# EAGLE design T05_version11_7b (EAGLE 7.1.0)
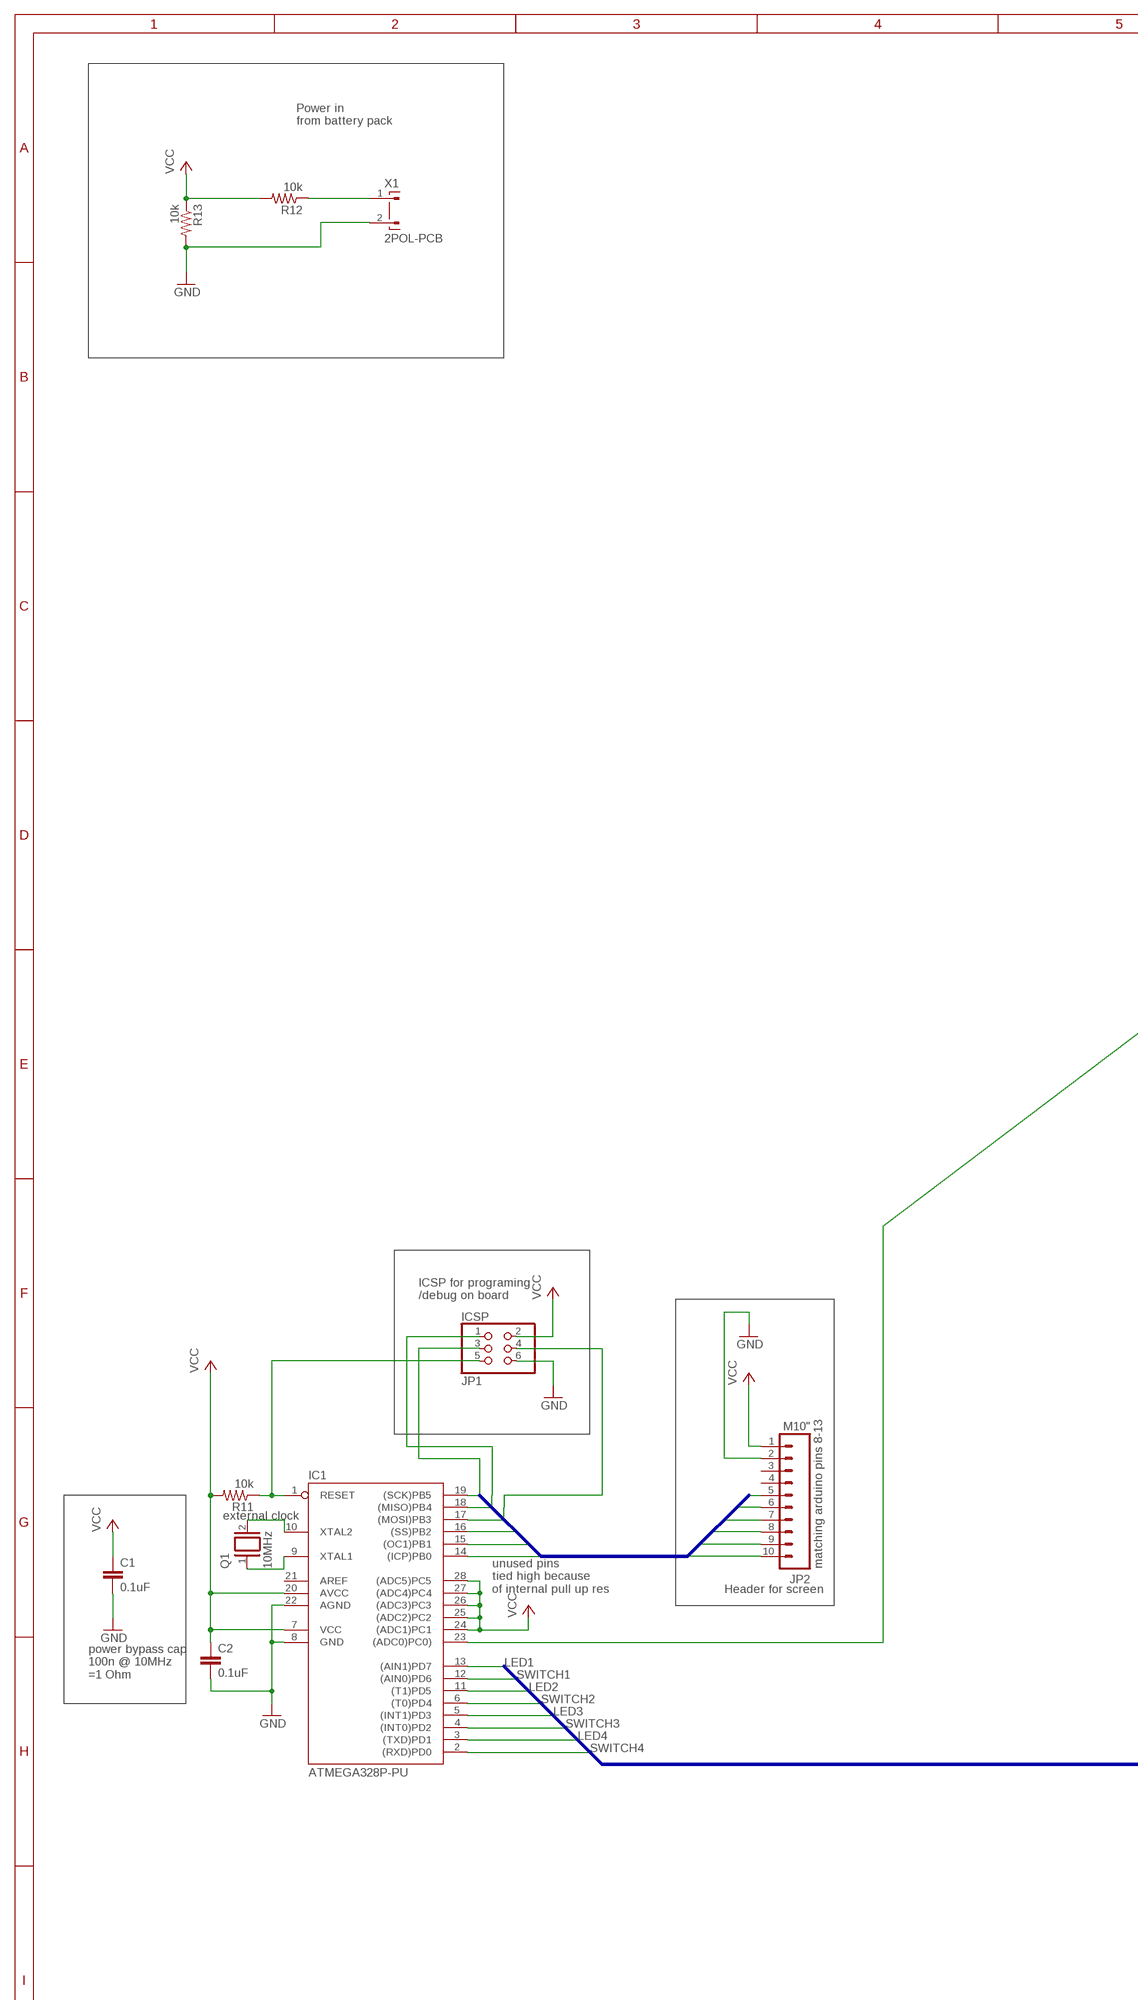
[diagram p0: schematic, sheet 1, part 1 of 2]
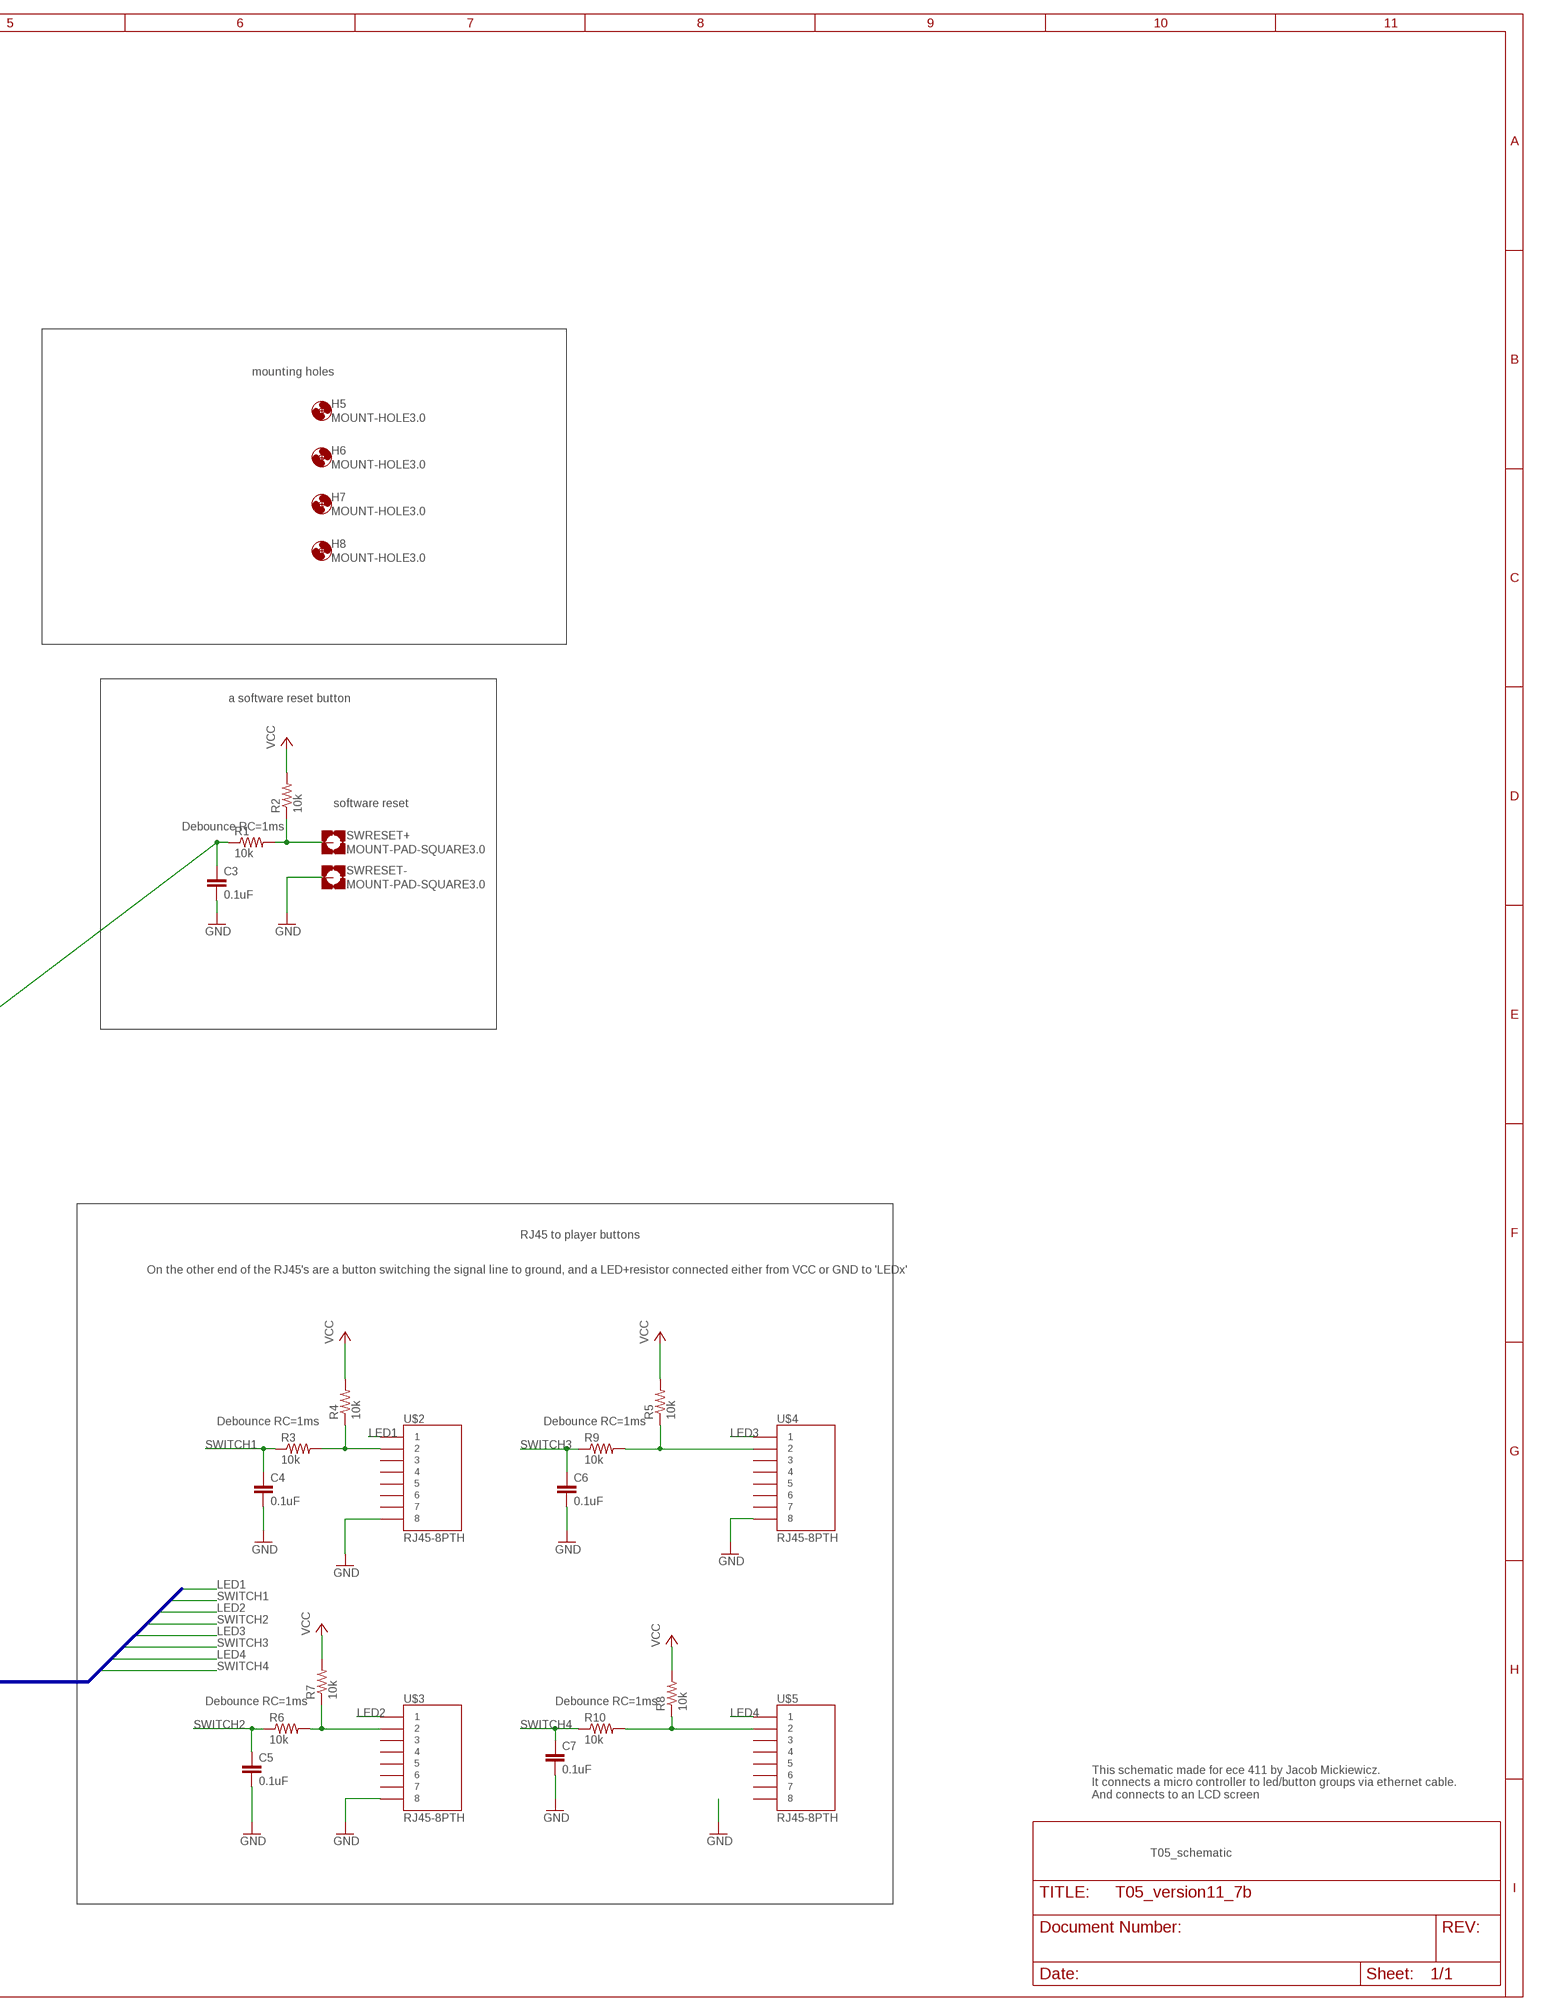
[diagram p1: schematic, sheet 1, part 2 of 2]

## Parts
C1  0.1uF  0.1UF-25V-5%(0603)  [0603-CAP]
C2  0.1uF  0.1UF-25V-5%(0603)  [0603-CAP]
C3  0.1uF  0.1UF-25V-5%(0603)  [0603-CAP]
C4  0.1uF  0.1UF-25V-5%(0603)  [0603-CAP]
C5  0.1uF  0.1UF-25V-5%(0603)  [0603-CAP]
C6  0.1uF  0.1UF-25V-5%(0603)  [0603-CAP]
C7  0.1uF  0.1UF-25V-5%(0603)  [0603-CAP]
H5  MOUNT-HOLE3.0  [3,0]
H6  MOUNT-HOLE3.0  [3,0]
H7  MOUNT-HOLE3.0  [3,0]
H8  MOUNT-HOLE3.0  [3,0]
IC1  ATMEGA328P-PU  [DIL28-3]
ICSP  JP1  PINHD-2X3  [2X03]
JP2  M10"  [1X10]
Q1  10MHz  XTAL/S  [QS]
R1  10k  RESISTOR0603-RES  [0603-RES]
R2  10k  RESISTOR0603-RES  [0603-RES]
R3  10k  RESISTOR0603-RES  [0603-RES]
R4  10k  RESISTOR0603-RES  [0603-RES]
R5  10k  RESISTOR0603-RES  [0603-RES]
R6  10k  RESISTOR0603-RES  [0603-RES]
R7  10k  RESISTOR0603-RES  [0603-RES]
R8  10k  RESISTOR0603-RES  [0603-RES]
R9  10k  RESISTOR0603-RES  [0603-RES]
R10  10k  RESISTOR0603-RES  [0603-RES]
R11  10k  RESISTOR0603-RES  [0603-RES]
R12  10k  RESISTOR0603-RES  [0603-RES]
R13  10k  RESISTOR0603-RES  [0603-RES]
SWRESET+  MOUNT-PAD-SQUARE3.0  [3,0-PAD-SQUARE]
SWRESET-  MOUNT-PAD-SQUARE3.0  [3,0-PAD-SQUARE]
U$2  RJ45-8PTH  [RJ45-8]
U$3  RJ45-8PTH  [RJ45-8]
U$4  RJ45-8PTH  [RJ45-8]
U$5  RJ45-8PTH  [RJ45-8]
X1  2POL-PCB  [2POL-PCB]

## Nets
GND: C1.2 C2.2 C3.2 C4.2 C5.2 C6.2 C7.2 IC1.8(GND) IC1.22(AGND) ICSP.6 JP2.2 R13.2 SWRESET-.B3,0(MOUNT) U$2.8 U$3.8 U$4.8 X1.2
ICP: IC1.14((ICP)PB0) JP2.10
LED1: IC1.13((AIN1)PD7) U$2.1
LED2: IC1.11((T1)PD5) U$3.1
LED3: IC1.5((INT1)PD3) U$4.1
LED4: IC1.3((TXD)PD1) U$5.1
MISO: IC1.18((MISO)PB4) ICSP.1 JP2.6
MOSI: IC1.17((MOSI)PB3) ICSP.4 JP2.7
N$3: IC1.1(RESET) ICSP.5 R11.1
N$8: R3.2 R4.1 U$2.2
N$9: R8.1 R10.2 U$5.2
N$10: R1.2 R2.1 SWRESET+.B3,0(MOUNT)
N$12: R6.2 R7.1 U$3.2
N$13: R5.1 R9.2 U$4.2
N$14: IC1.10(XTAL2) Q1.2
N$15: IC1.9(XTAL1) Q1.1
N$16: R12.1 X1.1
OC1: IC1.15((OC1)PB1) JP2.9
SCK: IC1.19((SCK)PB5) ICSP.3 JP2.5
SS: IC1.16((SS)PB2) JP2.8
SW_RESET: C3.1 IC1.23((ADC0)PC0)) R1.1
SWITCH1: C4.1 IC1.12((AIN0)PD6) R3.1
SWITCH2: C5.1 IC1.6((T0)PD4) R6.1
SWITCH3: C6.1 IC1.4((INT0)PD2) R9.1
SWITCH4: C7.1 IC1.2((RXD)PD0) R10.1
VCC: C1.1 C2.1 IC1.7(VCC) IC1.20(AVCC) IC1.24((ADC1)PC1) IC1.25((ADC2)PC2) IC1.26((ADC3)PC3) IC1.27((ADC4)PC4) IC1.28((ADC5)PC5) ICSP.2 JP2.1 R2.2 R4.2 R5.2 R7.2 R8.2 R11.2 R12.2 R13.1
Unconnected: IC1.21(AREF) JP2.3 JP2.4 U$2.3 U$2.4 U$2.5 U$2.6 U$2.7 U$3.3 U$3.4 U$3.5 U$3.6 U$3.7 U$4.3 U$4.4 U$4.5 U$4.6 U$4.7 U$5.3 U$5.4 U$5.5 U$5.6 U$5.7 U$5.8

## Buses
PLAYER_BUTTONS:LED[1..4],SWITCH[1..4]
PORT_B:SCK,MISO,MOSI,SS,OC1,ICP

## Notes on the sheet
- Power in
  from battery pack
- mounting holes
- a software reset button
- software reset
- Debounce RC=1ms
- ICSP for programing
  /debug on board
- RJ45 to player buttons
- On the other end of the RJ45's are a button switching the signal line to ground, and a LED+resistor connected either from VCC or GND to 'LEDx'
- Debounce RC=1ms | Debounce RC=1ms
- external clock
- matching arduino pins 8-13
- unused pins
  tied high because 
  of internal pull up res
- Header for screen
- power bypass cap
  100n @ 10MHz
  =1 Ohm
- Debounce RC=1ms | Debounce RC=1ms
- This schematic made for ece 411 by Jacob Mickiewicz.
  It connects a micro controller to led/button groups via ethernet cable.
  And connects to an LCD screen
- T05_schematic

## Library data of the parts
C1-C7 = SparkFun-Capacitors:0.1UF-25V-5%(0603): CAP-08604; PROD_ID: CAP-08604
H5-H8 = holes:MOUNT-HOLE: MOUNTING HOLE with drill center marker
IC1 = SmartPrj:ATMEGA328P-: MICROCONTROLLER 4 Kbytes FLASH 128 bytes SRAM 256 bytes EEPROM UART 6-channel 10 bit ADC
ICSP = SparkFun-Connectors:PINHD-2X3: PIN HEADER
JP2 = SparkFun-Connectors:M10: Header 10 Standard 10-pin 0.1" header. Use with straight break away headers (SKU : PRT-00116), right angle break away headers (PRT-00553), swiss pins (PRT-00743), machine pins (PRT-00117), and female headers (PRT-00115).
Q1 = special:XTAL/S: CRYSTAL
R1-R13 = SparkFun-Passives:RESISTOR: Resistor Basic schematic elements and footprints for 0603, 1206, and PTH resistors.
SWRESET+ SWRESET- = holes:MOUNT-PAD-SQUARE: MOUNTING PAD, square
U$2-U$5 = SparkFun-Connectors:RJ45-8: RJ45 Jack Simple RJ45, 8-pin connection - connector for common Cat5, Cat5e, and Cat6 Ethernet cables. Footprint not yet proven in production. Connector sku is PRT-00643; Breakout PCB sku is BOB-00716.
X1 = con-friwo:2POL-PCB: PCB SUPPLY CONNECTOR FRIWO (TEXAS); OC_FARNELL: unknown; OC_NEWARK: unknown

## Net classes
0 gnd: width 0.813 mm, clearance 0.178 mm
1 vcc: width 0.813 mm, clearance 0.178 mm to class 0, clearance 0.178 mm
2 default: width 0.254 mm, clearance 0.178 mm to class 0, clearance 0.178 mm to class 1, clearance 0.178 mm

## Board
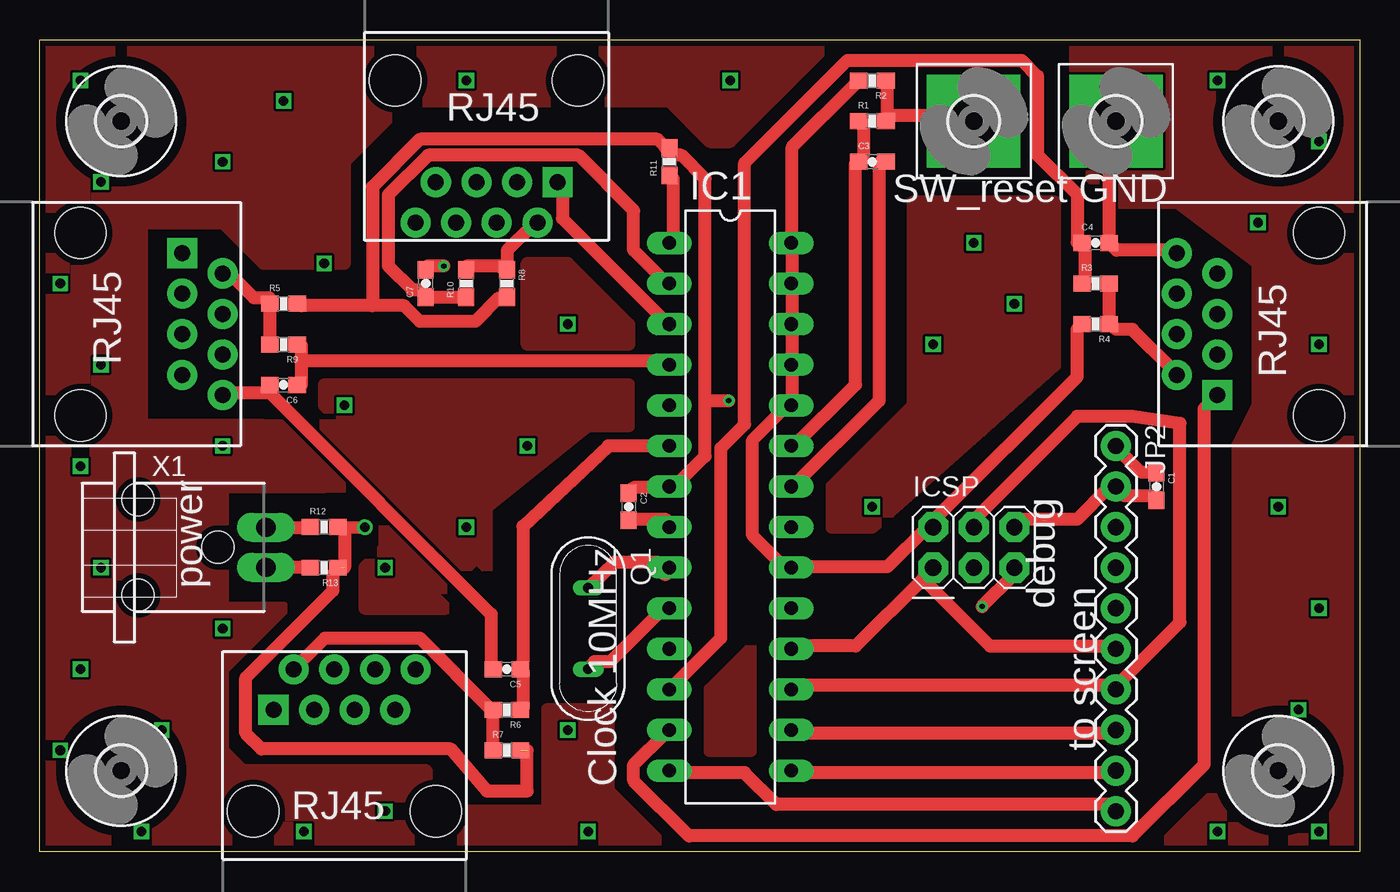
[diagram p2: board, top side]
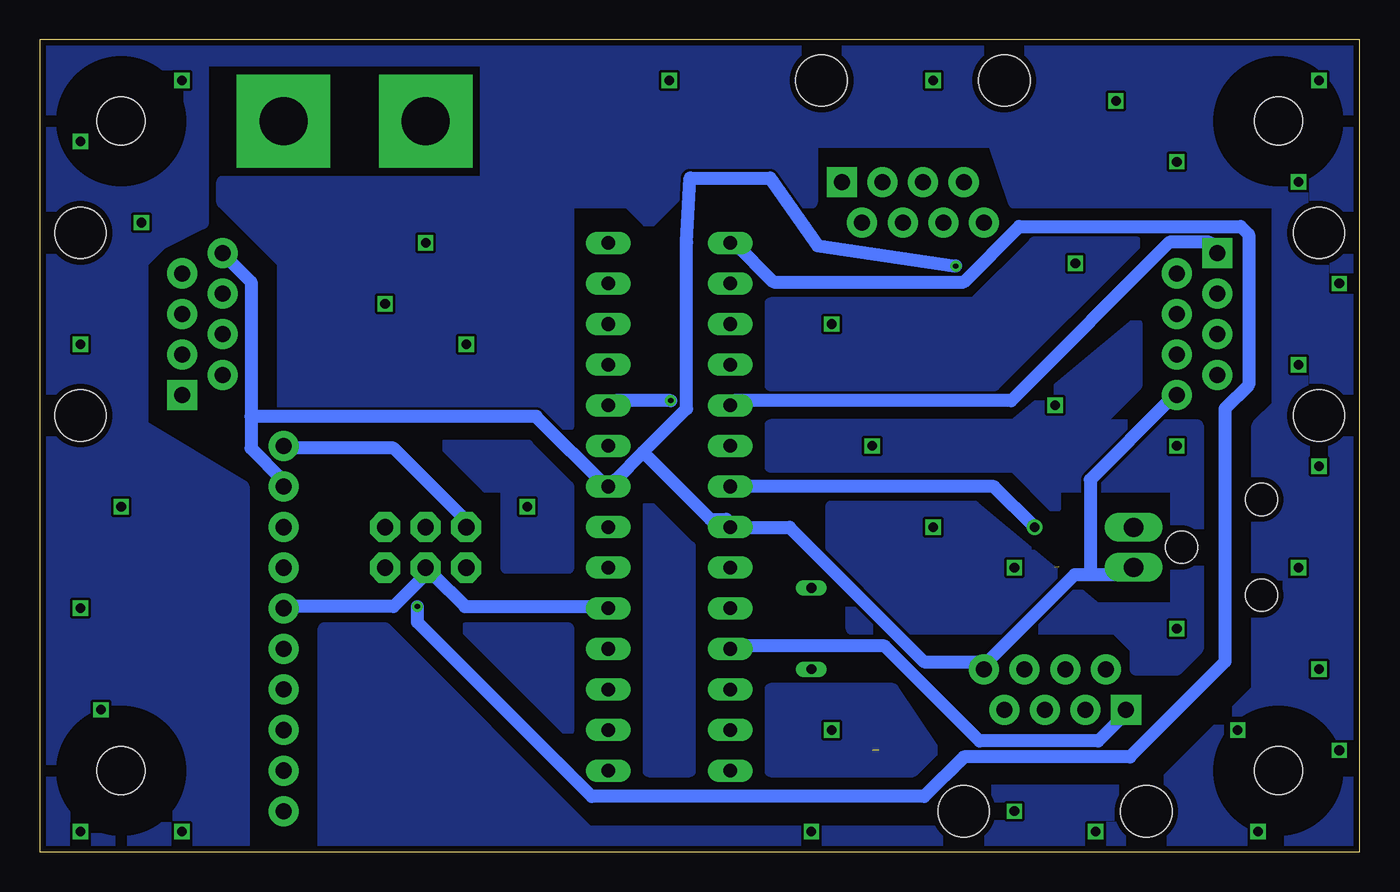
[diagram p3: board, bottom side, seen from below]

Size 82.55 x 50.8 mm. Coordinates in mm from the lower left corner, seen from the top.
Outline: 0,50.8 82.55,50.8 82.55,0 0,0 0,50.8
Copper layers (1*16): Top 0.0356mm / dielectric 1.5011mm / Bottom 0.0356mm
Design rules "OSH-Park-2-layer *": minimum track width 6mil, minimum drill 13mil, track to track 6mil, track to pad 6mil, pad to pad 6mil, via to via 6mil, smd to smd 6mil, copper to edge 15mil, drill to drill 10mil, minimum pad ring 7mil, minimum via ring 7mil, stop-mask expansion 3mil, vias tented up to drill 0mil, thermal gap 10mil

### Footprints (pad centres in the part's own frame; a part is rotated, then mirrored left to right if it is on the bottom)
0603-CAP = smd 1.1 x 1: 1 -0.85,0; 2 0.85,0
3,0 = hole 3: 0,0
DIL28-3 = drill 0.85 pad 1.422 long: 1 -16.51,-3.81; 2 -13.97,-3.81; 3 -11.43,-3.81; 4 -8.89,-3.81; 5 -6.35,-3.81; 6 -3.81,-3.81; 7 -1.27,-3.81; 8 1.27,-3.81; 9 3.81,-3.81; 10 6.35,-3.81; 11 8.89,-3.81; 12 11.43,-3.81; 13 13.97,-3.81; 14 16.51,-3.81; 15 16.51,3.81; 16 13.97,3.81; 17 11.43,3.81; 18 8.89,3.81; 19 6.35,3.81; 20 3.81,3.81; 21 1.27,3.81; 22 -1.27,3.81; 23 -3.81,3.81; 24 -6.35,3.81; 25 -8.89,3.81; 26 -11.43,3.81; 27 -13.97,3.81; 28 -16.51,3.81
2X03 = drill 1.016 pad 1.88 octagon: 1 -2.54,-1.27; 2 -2.54,1.27; 3 0,-1.27; 4 0,1.27; 5 2.54,-1.27; 6 2.54,1.27
1X10 = drill 1.016 pad 1.88: 1 0,0; 2 2.54,0; 3 5.08,0; 4 7.62,0; 5 10.16,0; 6 12.7,0; 7 15.24,0; 8 17.78,0; 9 20.32,0; 10 22.86,0
QS = drill 0.61 long: 1 -2.54,0; 2 2.54,0
0603-RES = smd 1.1 x 1: 1 -0.85,0; 2 0.85,0
3,0-PAD-SQUARE = drill 3 pad 5.842 square: B3,0 0,0
RJ45-8 = drill 1 pad 1.88 square: 1 -4.445,6.35 | drill 1 pad 1.88: 2 -3.175,8.89; 3 -1.905,6.35; 4 -0.635,8.89; 5 0.635,6.35; 6 1.905,8.89; 7 3.175,6.35; 8 4.445,8.89 | hole 3.2: -5.715,0; 5.715,0
2POL-PCB = drill 1.2 long: 1 -1.25,11.6; 2 1.25,11.6 | hole 2: -3,3.6; 3,3.6; 0,8.6

### Placement (x,y rotation side)
C1  69.85,22.86 270 top
C2  36.83,21.59 270 top
C3  52.07,43.18 0 top
C4  66.04,38.1 0 top
C5  29.21,11.43 180 top
C6  15.24,29.21 180 top
C7  24.13,35.56 90 top
H5  77.47,5.08 0 top
H6  77.47,45.72 0 top
H7  5.08,45.72 0 top
H8  5.08,5.08 0 top
IC1  43.18,21.59 270 top
ICSP  58.42,19.05 0 top
JP2  67.31,25.4 270 top
Q1  34.29,13.97 270 top
R1  52.07,45.72 0 top
R2  52.07,48.26 180 top
R3  66.04,35.56 0 top
R4  66.04,33.02 180 top
R5  15.24,34.29 0 top
R6  29.21,8.89 180 top
R7  29.21,6.35 0 top
R8  29.21,35.56 270 top
R9  15.24,31.75 180 top
R10  26.67,35.56 90 top
R11  39.37,43.18 90 top
R12  17.78,20.32 0 top
R13  17.78,17.78 180 top
SWRESET+  58.42,45.72 0 top
SWRESET-  67.31,45.72 0 top
U$2  80.01,33.02 90 top
U$3  19.05,2.54 0 top
U$4  2.54,33.02 270 top
U$5  27.94,48.26 180 top
X1  2.54,19.05 270 top

### Tracks (layer width: path | path; a pad name or v marks a point on that pad's centre or on a via)
GND  (via drill 0.33)
  Top 0.813: C1.2 69.84,22.29 67.86,22.29 67.36,22.78 JP2.2 66.86,22.78 64.88,20.8 61.42,20.8 ICSP.6 | U$2.8 70.83,37.64 67.36,37.64 C4.2 66.86,38.14 66.86,45.57 SWRESET-.B3,0 | R13.2 16.84,17.83 14.36,17.83 X1.2 | 14.36,28.73 11.89,28.73 U$4.8 | 14.36,28.73 28.23,14.86 28.23,11.89 C5.2 | 14.36,28.73 C6.2 | C2.2 37.15,20.8 39.13,20.8 IC1.8 | v25.26,36.65 24.27,36.65 C7.2 | C3.2 52.5,43.09 52.5,28.23 47.05,22.78 IC1.22
  Bottom 0.813: 69.34,27.24 69.34,35.66 70.83,37.15 U$2.8 | 69.34,27.24 69.34,25.26 67.36,23.28 JP2.2 | 16.84,17.34 14.36,17.34 X1.2 | 16.84,17.34 17.83,17.34 23.28,11.89 U$3.8 23.77,11.89 27.24,11.89 35.66,20.31 39.13,20.31 IC1.8 39.62,20.8 40.62,20.8 44.83,25.01 | 16.84,17.34 16.84,23.28 11.89,28.23 U$4.8 | v25.26,36.65 33.9,37.92 36.87,42.16 41.88,42.16 42.1,38.14 42.1,27.74 44.83,25.01 | 44.83,25.01 46.56,23.28 IC1.22 47.05,22.78 51.51,27.24 69.34,27.24
ICP
  Top 0.813: IC1.14 39.62,4.95 44.08,4.95 46.06,2.97 66.86,2.97 JP2.10
LED1
  Top 0.813: IC1.13 39.13,7.43 37.15,5.45 37.15,4.46 40.62,0.99 68.35,0.99 72.81,5.45 72.81,27.74 73.3,28.23 U$2.1
LED2
  Bottom 0.813: IC1.11 39.13,12.88 29.72,12.88 23.77,6.93 16.34,6.93 14.86,8.42 U$3.1
LED3
  Bottom 0.813: IC1.5 39.13,28.23 21.79,28.23 11.89,38.14 9.41,38.14 8.91,37.64 U$4.1
LED4
  Top 0.813: IC1.3 39.13,33.19 32.69,39.62 32.69,41.6 U$5.1
MISO
  Top 0.813: 55.23,17.09 55.47,17.34 ICSP.1 | 55.23,17.09 51.02,12.88 47.05,12.88 IC1.18 | 55.23,17.09 59.44,12.88 66.86,12.88 JP2.6
MOSI
  Top 0.813: IC1.17 47.05,10.4 66.86,10.4 JP2.7 67.36,10.4 71.32,14.36 71.32,26.81 68.35,27.24 64.88,27.24 58.45,20.8 ICSP.4
N$1  (via drill 0.6)
  other vias: 20.32,20.32
N$2
  pour Top: 0,0 39.37,0 35.56,3.81 35.56,8.89 31.75,8.89 31.75,2.54 26.67,2.54 24.13,5.08 12.7,5.08 11.43,6.35 11.43,11.43 15.24,15.24 11.43,15.24 11.43,21.59 11.43,22.86 17.78,22.86 13.97,26.67 7.62,26.67 6.35,26.67 6.35,39.37 11.43,39.37 13.97,36.83 19.05,36.83 19.05,43.18 22.86,46.99 39.37,46.99 41.91,44.45 43.18,44.45 49.53,50.8 0,50.8
N$3  (via drill 0.33)
  Top 0.813: R11.1 39.62,42.1 39.62,38.14 IC1.1 | v58.94,15.35 60.92,17.34 ICSP.5
  Bottom 0.813: v58.94,15.35 58.94,14.36 48.04,3.47 27.24,3.47 24.77,5.94 14.36,5.94 8.42,11.89 8.42,27.74 6.93,29.22 6.93,38.63 7.43,39.13 21.3,39.13 24.77,35.66 36.65,35.66 39.13,38.14 IC1.1
N$4
  pour Top: 17.78,29.21 17.78,27.94 27.94,17.78 27.94,21.59 34.29,26.67 36.83,26.67 36.83,29.21
N$5
  pour Top: 49.53,22.86 49.53,20.32 52.07,20.32 63.5,30.48 63.5,40.64 54.61,40.64 54.61,27.94
N$6
  pour Top: 41.91,10.16 41.91,6.35 44.45,6.35 44.45,12.7
N$7
  pour Top: 69.85,0 82.55,0 82.55,50.8 71.12,50.8 71.12,40.64 76.2,36.83 76.2,27.94 74.93,25.4 74.93,5.08
N$8
  Top 0.813: R3.2 66.86,35.17 66.86,33.19 R4.1 67.36,32.69 68.35,32.69 70.83,30.21 U$2.2
N$9
  Top 0.813: R10.2 26.75,36.65 28.73,36.65 R8.1 29.22,36.65 29.22,37.64 30.71,39.13 U$5.2
N$10
  Top 0.813: 53,46.06 53,48.04 R2.1 | 53,46.06 57.95,46.06 SWRESET+.B3,0 | 53,46.06 R1.2
N$11
  pour Bottom: 64.77,0 64.77,13.97 60.96,13.97 48.26,1.27 26.67,1.27 24.13,3.81 12.7,3.81 6.35,10.16 6.35,26.67 5.08,27.94 5.08,40.64 21.59,40.64 22.86,44.45 34.29,44.45 34.29,40.64 36.83,40.64 38.1,41.91 41.91,41.91 44.45,39.37 45.72,40.64 49.53,40.64 49.53,26.67 67.31,26.67 67.31,36.83 71.12,40.64 71.12,41.91 54.61,41.91 54.61,49.53 72.39,49.53 72.39,39.37 74.93,38.1 76.2,36.83 76.2,26.67 69.85,22.86 69.85,0 82.55,0 82.55,50.8 0,50.8 0,0
N$12
  Top 0.813: U$3.2 16.34,11.89 17.83,13.37 23.77,13.37 28.23,8.91 R6.2 R7.1
N$13
  Top 0.813: R9.2 14.36,32.19 14.36,34.18 R5.1 14.36,34.67 13.37,34.67 11.89,36.16 U$4.2
N$14
  Top 0.813: Q1.2 34.67,11.89 35.66,11.89 39.13,15.35 IC1.10
N$15
  Top 0.813: Q1.1 35.94,18.11 38.63,18.11 39.13,17.34 IC1.9
N$16
  Top 0.813: R12.1 16.84,20.31 14.36,20.31 X1.1
N$17
  pour Bottom: 41.91,19.05 44.45,21.59 44.45,5.08 41.91,5.08
N$18
  pour Bottom: 49.53,22.86 49.53,17.78 53.34,17.78 53.34,22.86 54.61,22.86 57.15,25.4 52.07,25.4
N$19
  pour Bottom: 49.53,13.97 49.53,7.62 55.88,13.97
N$20
  pour Bottom: 33.02,21.59 24.13,21.59 16.51,15.24 11.43,15.24 11.43,22.86 20.32,22.86 16.51,26.67 10.16,26.67 10.16,12.7 11.43,11.43 13.97,11.43 13.97,12.7 15.24,13.97 31.75,13.97 31.75,17.78 33.02,19.05
N$21
  pour Bottom: 36.83,26.67 36.83,24.13 21.59,24.13 19.05,21.59 19.05,24.13 13.97,29.21 13.97,33.02 21.59,26.67
N$22
  pour Bottom: 13.97,38.1 20.32,38.1 24.13,34.29 36.83,34.29 36.83,29.21 22.86,29.21
N$23
  pour Top: 71.12,50.8 64.77,50.8 64.77,43.18 67.31,40.64 72.39,40.64 72.39,50.8
N$24
  pour Bottom: 29.21,10.16 36.83,10.16 36.83,5.08 27.94,5.08 26.67,6.35
N$25  (via drill 0.6)
  other vias: 52.07,21.59
N$26  (via drill 0.6)
  other vias: 55.88,31.75
N$27  (via drill 0.6)
  other vias: 60.96,34.29
N$28  (via drill 0.6)
  other vias: 58.42,38.1
N$29  (via drill 0.6)
  other vias: 43.18,48.26
N$30  (via drill 0.6)
  other vias: 73.66,48.26
N$31  (via drill 0.6)
  other vias: 80.01,44.45
N$32  (via drill 0.6)
  other vias: 76.2,39.37
N$33  (via drill 0.6)
  other vias: 80.01,31.75
N$34  (via drill 0.6)
  other vias: 77.47,21.59
N$35  (via drill 0.6)
  other vias: 80.01,15.24
N$36  (via drill 0.6)
  other vias: 78.74,8.89
N$37  (via drill 0.6)
  other vias: 80.01,1.27
N$38  (via drill 0.6)
  other vias: 73.66,1.27
N$39  (via drill 0.6)
  other vias: 33.02,7.62
N$40  (via drill 0.6)
  other vias: 34.29,1.27
N$41  (via drill 0.6)
  other vias: 21.59,2.54
N$42  (via drill 0.6)
  other vias: 16.51,1.27
N$43  (via drill 0.6)
  other vias: 6.35,1.27
N$44  (via drill 0.6)
  other vias: 1.27,6.35
N$45  (via drill 0.6)
  other vias: 7.62,7.62
N$46  (via drill 0.6)
  other vias: 11.43,13.97
N$47  (via drill 0.6)
  other vias: 11.43,25.4
N$48
  pour Top: 20.32,17.78 20.32,15.24 25.4,15.24 21.59,19.05
N$49  (via drill 0.6)
  other vias: 21.59,17.78
N$50  (via drill 0.6)
  other vias: 26.67,20.32
N$51  (via drill 0.6)
  other vias: 30.48,25.4
N$52  (via drill 0.6)
  other vias: 19.05,27.94
N$53  (via drill 0.6)
  other vias: 17.78,36.83
N$54
  pour Top: 30.48,36.83 33.02,36.83 36.83,33.02 36.83,31.75 30.48,31.75
N$55  (via drill 0.6)
  other vias: 33.02,33.02
N$56  (via drill 0.6)
  other vias: 2.54,11.43
N$57  (via drill 0.6)
  other vias: 3.81,17.78
N$58  (via drill 0.6)
  other vias: 2.54,24.13
N$59  (via drill 0.6)
  other vias: 3.81,30.48
N$60  (via drill 0.6)
  other vias: 1.27,35.56
N$61  (via drill 0.6)
  other vias: 3.81,41.91
N$62  (via drill 0.6)
  other vias: 2.54,48.26
N$63  (via drill 0.6)
  other vias: 11.43,43.18
N$64  (via drill 0.6)
  other vias: 15.24,46.99
N$65  (via drill 0.6)
  other vias: 26.67,48.26
N$66
  pour Top: 13.97,26.67 20.32,26.67 27.94,19.05 25.4,16.51 24.13,16.51 21.59,16.51 21.59,22.86 13.97,22.86
OC1
  Top 0.813: IC1.15 47.05,4.95 66.86,4.95 JP2.9
SCK
  Bottom 0.813: IC1.19 47.05,15.35 55.97,15.35 57.95,17.34 ICSP.3 58.45,17.34 60.43,15.35 66.86,15.35 JP2.5
SS
  Top 0.813: IC1.16 47.05,7.43 66.86,7.43 JP2.8
SW_RESET
  Top 0.813: R1.1 51.51,45.57 51.51,43.59 C3.1 51.02,43.09 51.02,29.22 47.05,25.26 IC1.23
SWITCH1
  Top 0.813: R3.1 65.38,35.66 65.38,37.64 C4.1 64.88,38.14 64.88,41.11 62.41,43.59 62.41,48.54 61.42,49.53 50.52,49.53 44.08,43.09 44.08,26.75 42.6,25.26 42.6,13.37 39.62,10.4 IC1.12
SWITCH2
  Top 0.813: R6.1 30.21,8.91 30.21,11.39 C5.1 30.21,11.89 30.21,20.37 35.56,25.4 IC1.6
SWITCH3
  Top 0.813: 16.34,30.71 16.34,31.7 R9.1 | 16.34,30.71 16.34,29.22 C6.1 | 16.34,30.71 39.13,30.71 IC1.4
SWITCH4
  Top 0.813: R10.1 26.25,34.67 24.27,34.67 C7.1 23.77,35.17 23.28,35.17 21.79,36.65 21.79,41.11 24.27,43.59 33.68,43.59 37.15,40.12 37.15,37.64 39.13,35.66 IC1.2
VCC  (via drill 0.33, 0.6)  (2 unrouted)
  Top 0.813: R2.2 51.02,48.04 47.05,44.08 47.05,38.14 IC1.28 47.05,37.64 47.05,35.66 IC1.27 47.05,35.17 47.05,33.19 IC1.26 47.05,32.69 47.05,30.71 IC1.25 47.05,30.21 47.05,28.23 IC1.24 46.56,27.74 44.58,25.76 44.58,19.81 46.56,17.83 IC1.20 47.05,17.83 53,17.83 55.47,20.31 ICSP.2 55.97,20.8 64.88,29.72 64.88,32.69 R4.2 | C1.1 69.84,23.77 68.85,23.77 67.36,25.26 JP2.1 | 18.82,17.83 R13.1 18.33,17.34 18.33,16.34 12.88,10.9 12.88,7.43 13.87,6.44 25.69,6.44 27.94,3.81 30.48,3.81 30.48,6.35 | 20.8,34.18 22.78,34.18 23.77,33.19 27.24,33.19 28.73,34.67 R8.2 | 20.8,34.18 16.34,34.18 R5.2 | 41.6,28.23 41.6,24.77 39.62,22.78 IC1.7 39.13,22.78 37.15,22.78 C2.1 | 41.6,28.23 41.6,42.1 40.12,43.59 39.62,43.59 R11.2 39.13,44.08 38.63,44.58 23.77,44.58 20.8,41.6 20.8,34.18 | 41.6,28.23 v43.09,28.23 | 18.82,20.31 R12.2 | 18.82,20.31 19.05,20.32 19.05,17.78 | 18.82,20.31 v20.32,20.32
  Bottom 0.813: JP2.1 66.86,25.26 60.43,25.26 55.97,20.8 ICSP.2 | v43.09,28.23 46.56,28.23 IC1.24 | v20.32,20.32 22.86,22.86 IC1.7

### Text on the board
tSilk: RJ45 | SW_reset GND | RJ45 | RJ45 | Clock 10MHz | power | debug | to screen | RJ45